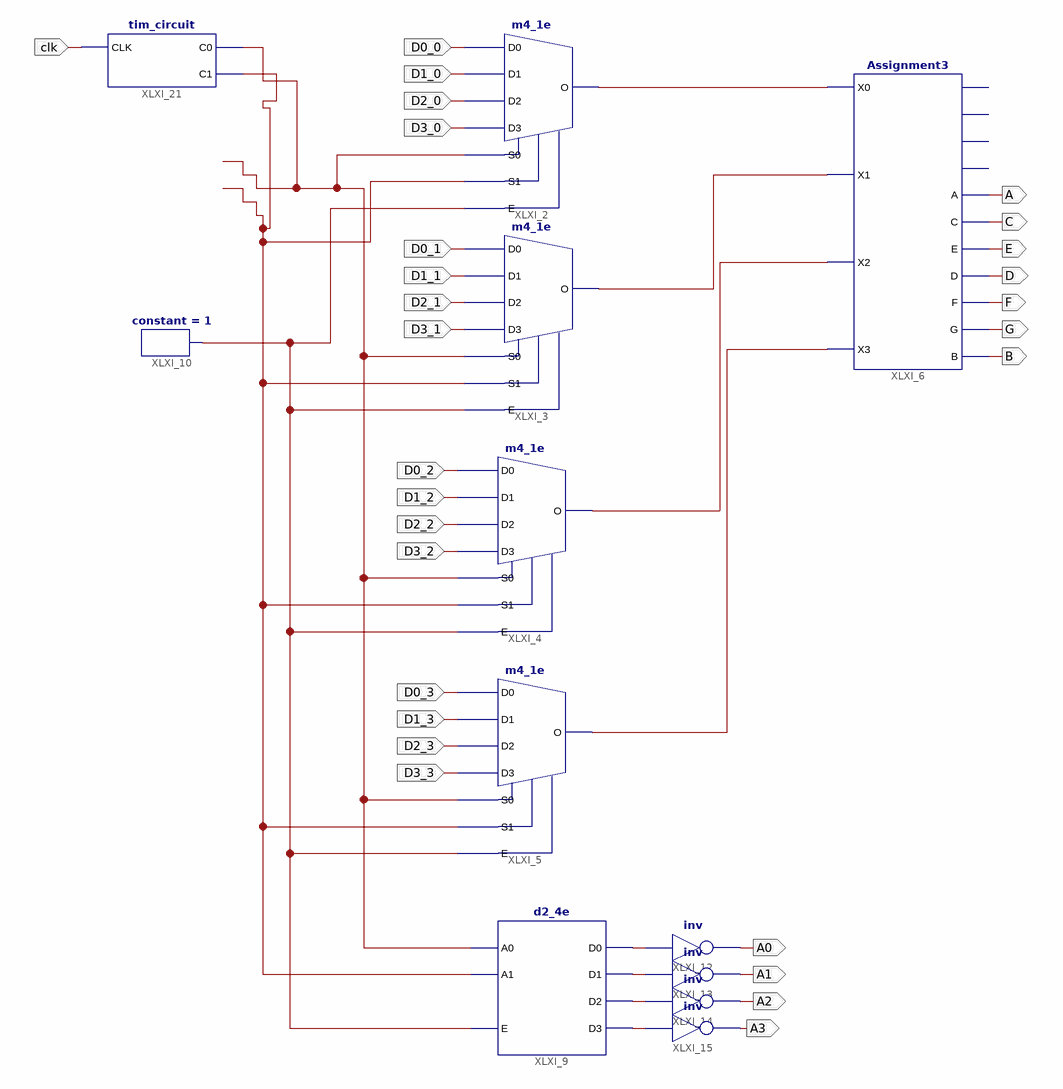
[diagram p0: schematic sheet 1]
// Xilinx ISE schematic Assignment4.sch (spartan6) as structural Verilog: 12 symbols, 28 ports
module Assignment4 (
  input  D0_0,
  input  D1_0,
  input  D2_0,
  input  D3_0,
  input  D0_1,
  input  D1_1,
  input  D2_1,
  input  D3_1,
  input  D0_2,
  input  D1_2,
  input  D2_2,
  input  D3_2,
  input  D0_3,
  input  D1_3,
  input  D2_3,
  input  D3_3,
  input  clk,
  output A0,
  output A1,
  output A2,
  output A3,
  output A,
  output C,
  output D,
  output E,
  output F,
  output G,
  output B
);

  wire XLXN_1, XLXN_2, XLXN_3, XLXN_4, XLXN_24, XLXN_27, XLXN_33, XLXN_34, XLXN_35, XLXN_36, XLXN_53;

  m4_1e XLXI_2 (.D0(D0_0), .D1(D1_0), .D2(D2_0), .D3(D3_0), .E(XLXN_27), .S0(XLXN_24), .S1(XLXN_53), .O(XLXN_1));
  m4_1e XLXI_3 (.D0(D0_1), .D1(D1_1), .D2(D2_1), .D3(D3_1), .E(XLXN_27), .S0(XLXN_24), .S1(XLXN_53), .O(XLXN_2));
  m4_1e XLXI_4 (.D0(D0_2), .D1(D1_2), .D2(D2_2), .D3(D3_2), .E(XLXN_27), .S0(XLXN_24), .S1(XLXN_53), .O(XLXN_3));
  m4_1e XLXI_5 (.D0(D0_3), .D1(D1_3), .D2(D2_3), .D3(D3_3), .E(XLXN_27), .S0(XLXN_24), .S1(XLXN_53), .O(XLXN_4));
  Assignment3 XLXI_6 (
    .X0(XLXN_1), .X1(XLXN_2), .X2(XLXN_3), .X3(XLXN_4), .A(A), .C(C), .E(E), .D(D), .F(F), .G(G), .B(B));  // open: AN0, AN1, AN2, AN3
  d2_4e XLXI_9 (.A0(XLXN_24), .A1(XLXN_53), .E(XLXN_27), .D0(XLXN_33), .D1(XLXN_34), .D2(XLXN_35), .D3(XLXN_36));
  constant #(.CValue("1")) XLXI_10 (.O(XLXN_27));
  not XLXI_12 (A0, XLXN_33);
  not XLXI_13 (A1, XLXN_34);
  not XLXI_14 (A2, XLXN_35);
  not XLXI_15 (A3, XLXN_36);
  tim_circuit XLXI_21 (.CLK(clk), .C0(XLXN_24), .C1(XLXN_53));
endmodule
